# Altium schematic sheet 共E单管放大.SchDoc
size A4; SheetNumber: 1; SheetTotal: 1
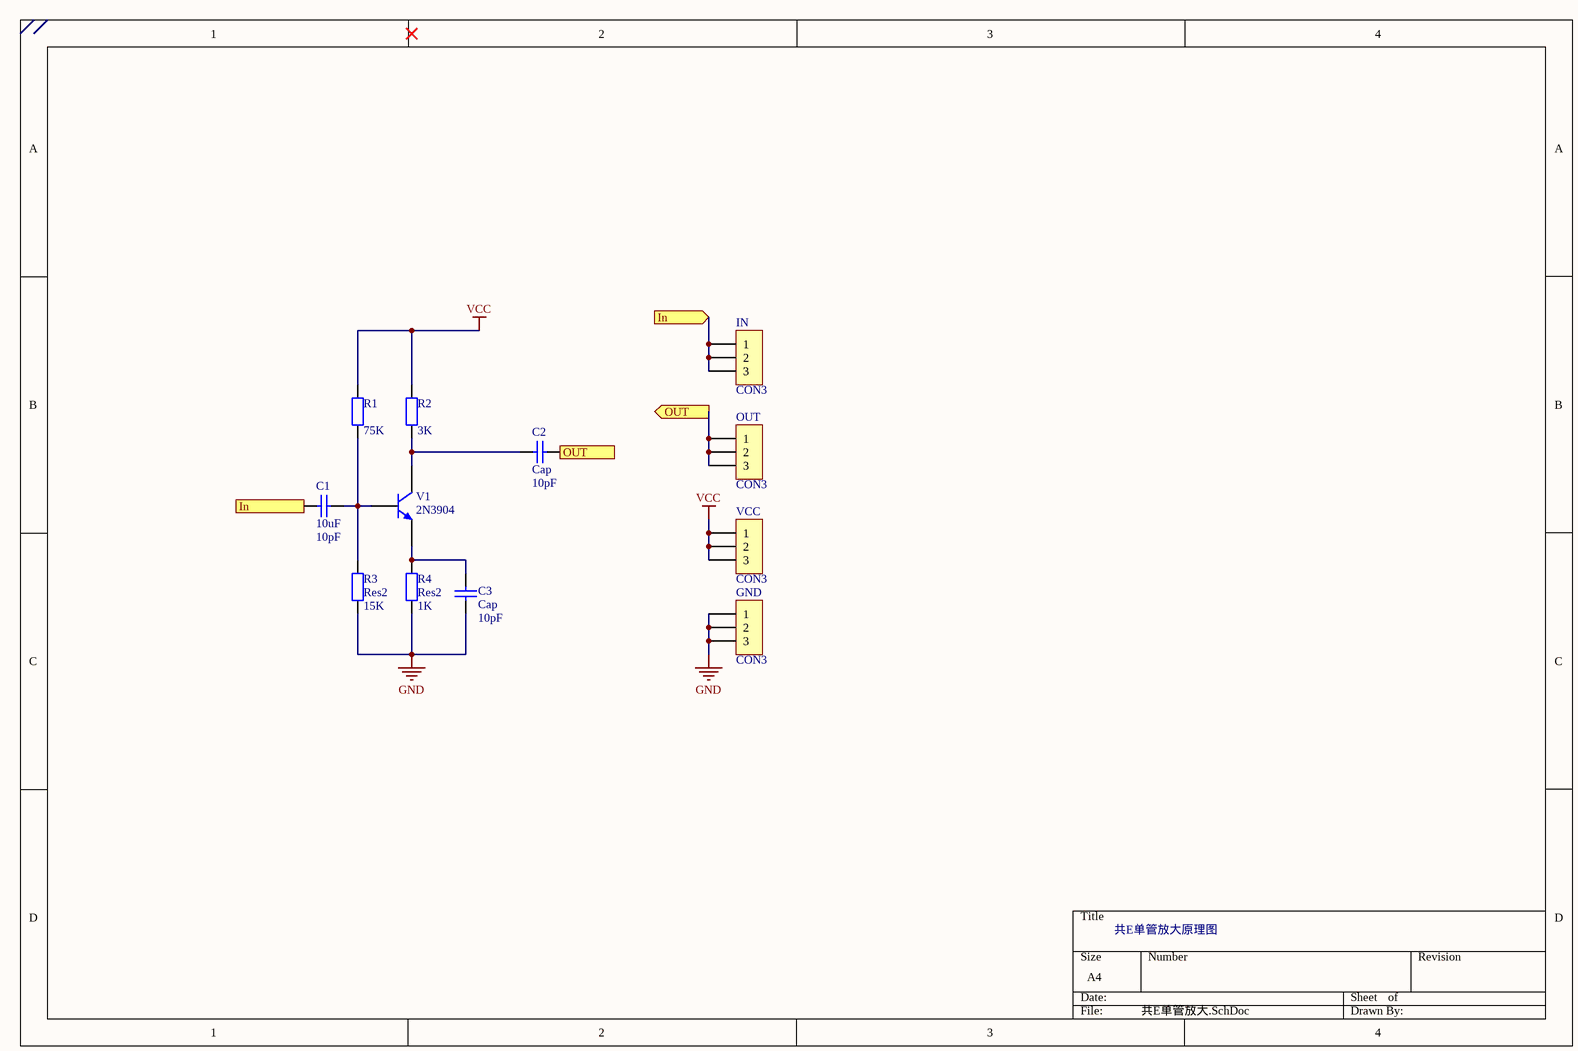
[diagram p0: 共E单管放大.SchDoc]

## Parts
C1  10uF  value 10pF  [CAP-1uF]
C2  Cap  value 10pF  [CAP-1uF]
C3  Cap  value 10pF  [CAP-1uF]
GND  CON3  [SIP3]
IN  CON3  [SIP3]
OUT  CON3  [SIP3]
R1  75K  [RES-1/2W-1]
R2  3K  [RES-1/2W-1]
R3  Res2  value 15K  [RES-1/2W-1]
R4  Res2  value 1K  [RES-1/2W-1]
V1  2N3904  [TO-92A]
VCC  CON3  [SIP3]

## Ports
In (in), OUT (out)

## Nets
GND: C3.2 GND.1 GND.2 GND.3 R3.1 R4.1
VCC: R1.2 R2.2 VCC.1 VCC.2 VCC.3
In: C1.2 IN.1 IN.2 IN.3 ; port In
OUT: C2.2 OUT.1 OUT.2 OUT.3 ; port OUT
NetC1_1: C1.1 R1.1 R3.2 V1.2(B)
NetC2_1: C2.1 R2.1 V1.3(C)
NetC3_1: C3.1 R4.2 V1.1(E)

## Notes on the sheet
- 共E单管放大原理图

## Library data of the parts
C1-C3 = Cap: Capacitor; Published: 8-Jun-2000; LatestRevisionDate: 17-Jul-2002; LatestRevisionNote: Re-released for DXP Platform.; PackageReference: RAD-0.3; Publisher: Altium Limited; PackageDescription: Radial Cap, Thru-Hole; 2 Leads; 0.3 in Pin Spacing
R1-R4 = Res2: Resistor; Published: 8-Jun-2000; LatestRevisionDate: 17-Jul-2002; LatestRevisionNote: Re-released for DXP Platform.; PackageReference: AXIAL-0.4; Publisher: Altium Limited; PackageDescription: Axial Device, Thru-Hole; 2 Leads; 0.4 in Pin Spacing
  R1: Value: 75K
  R2: Value: 3K
V1 = 2N3904: NPN General Purpose Amplifier; Published: 8-Jun-2000; LatestRevisionDate: 15-Jan-2003; LatestRevisionNote: PCB Footprint 'BCY-W3/D4.7' replaced; DatasheetVersion: 1997; PackageVersion: Sep-1998; PackageReference: TO-92A; Publisher: Altium Limited; PackageDescription: TO, Flat Index; 3 In-Line, Axial Leads; Body Dia. 4.5mm; Leads 0.51 x 0.48 mm (max); ComponentLink1Description: Manufacturer Link; ComponentLink1URL: http://www.fairchildsemi.com/; ComponentLink2Description: Datasheet; ComponentLink2URL: http://www.fairchildsemi.com/ds/2N%2F2N3904.pdf